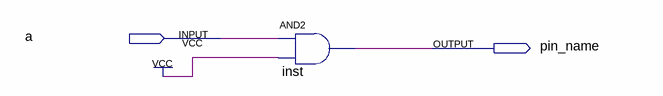
[diagram p0: schematic sheet]
// Quartus schematic test sinal.bdf as structural Verilog: 1 symbols, 2 pins
module \test_sinal  (
  input  a,
  output pin_name
);

  and inst (pin_name, a, 1'b1);
endmodule
